# EAGLE schematic design (EAGLE 9.5.1)

## Sheet 1 of 2: DC/DC converters
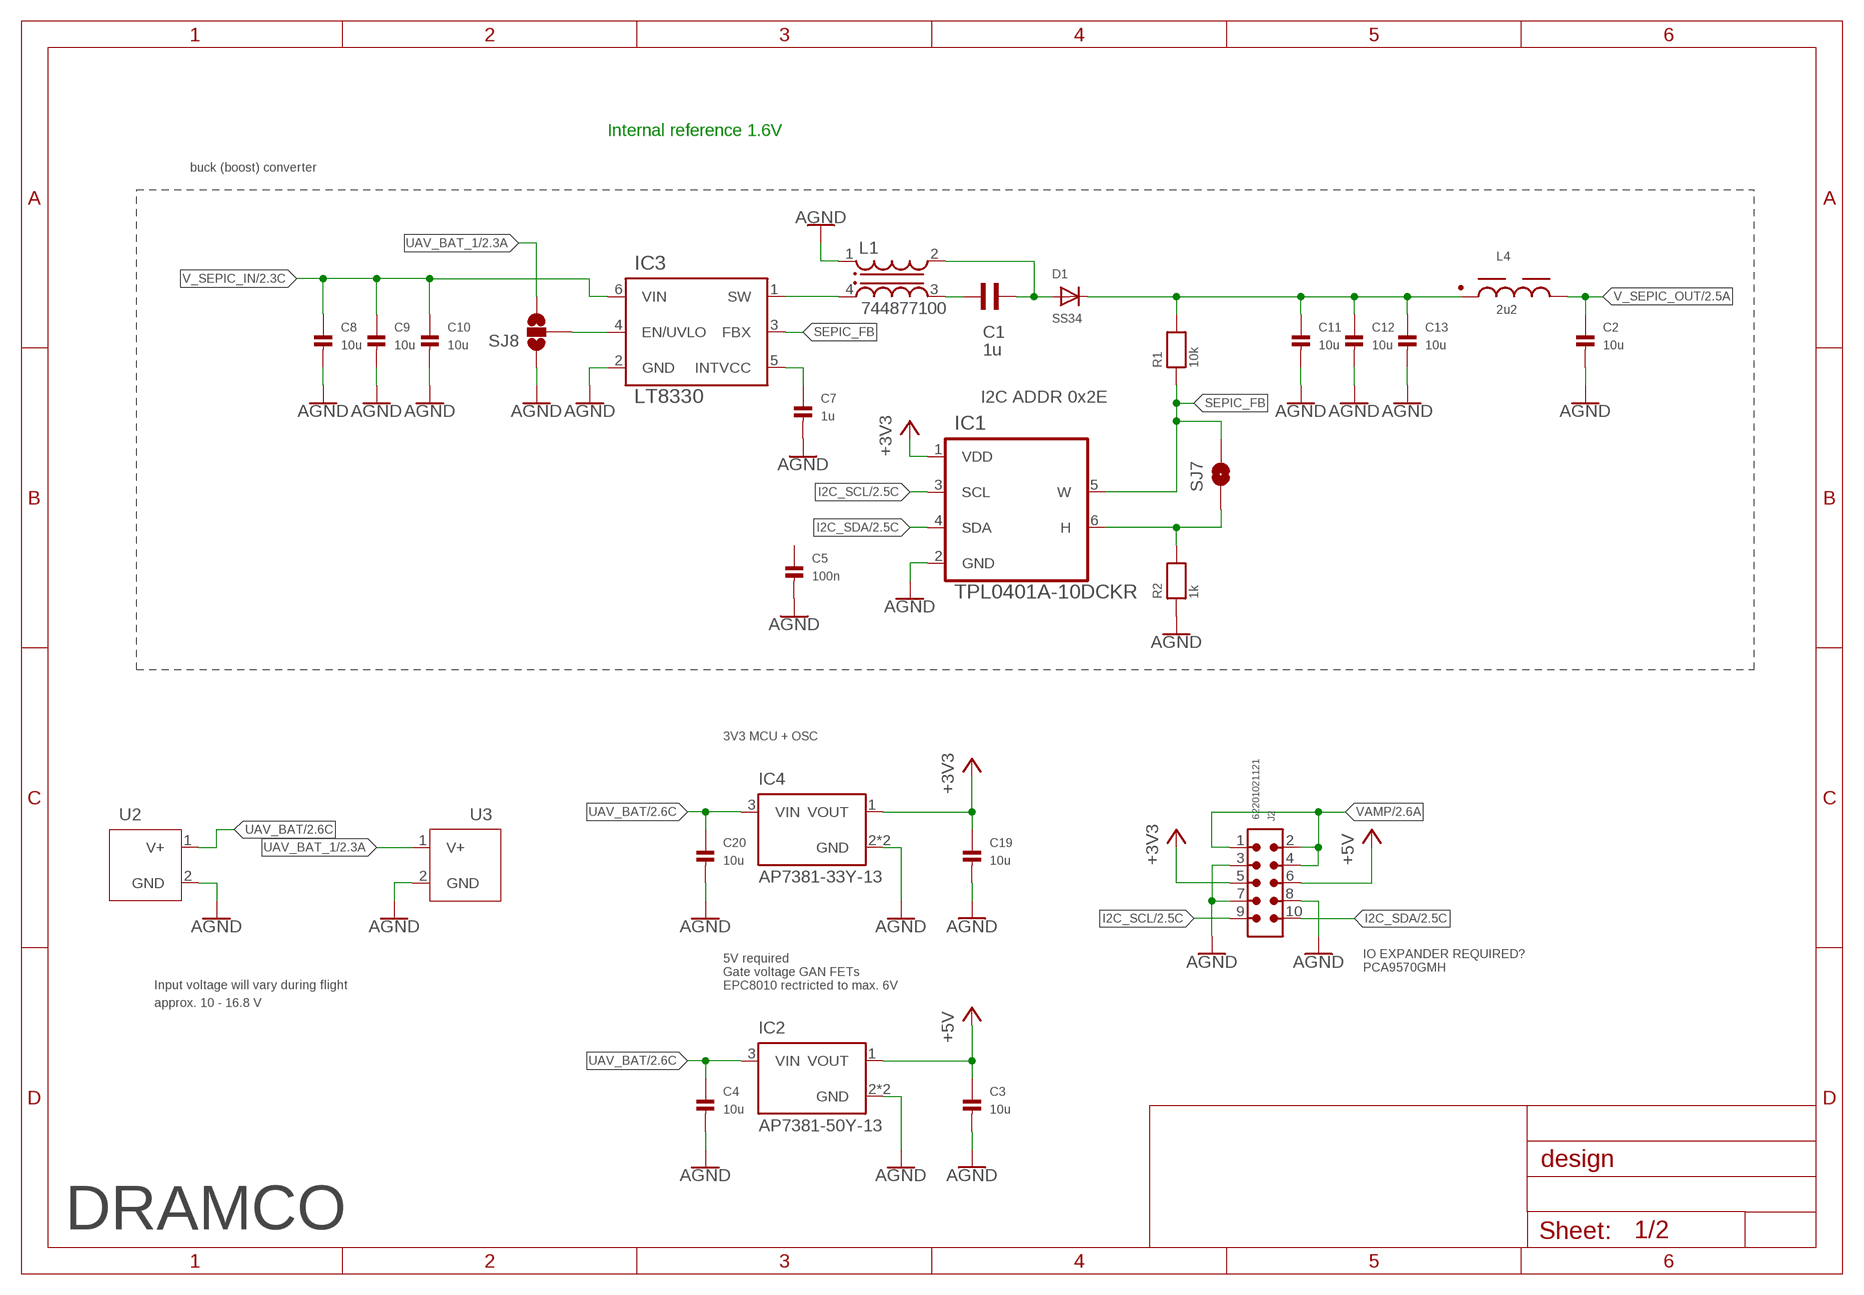
[diagram p0: schematic, sheet 1]

### Parts
C1  1u  WCAP-CSGP_0805_885012207103_WAVE  [WCAP-CSGP_0805_WAVE]
C2  10u  CAP_CERAMIC0805  [0805]
C3  10u  CAP_CERAMIC0603  [0603]
C4  10u  CAP_CERAMIC0603  [0603]
C5  100n  CAP_CERAMIC0402  [0402]
C7  1u  CAP_CERAMIC0603  [0603]
C8  10u  CAP_CERAMIC1206  [1206]
C9  10u  CAP_CERAMIC1206  [1206]
C10  10u  CAP_CERAMIC1206  [1206]
C11  10u  CAP_CERAMIC1206  [1206]
C12  10u  CAP_CERAMIC1206  [1206]
C13  10u  CAP_CERAMIC1206  [1206]
C19  10u  CAP_CERAMIC0603  [0603]
C20  10u  CAP_CERAMIC0603  [0603]
D1  SS34  DIODESOD-123  [SOD-123]
IC1  TPL0401A-10DCKR  [SOT65P210X110-6N]
IC2  AP7381-50Y-13  [FOOT_XC6201P332PR-G]
IC3  LT8330  LT8330ES6TR  [TSOT-23_S6]
IC4  AP7381-33Y-13  AP7381-50Y-13  [FOOT_XC6201P332PR-G]
J2  62201021121  6220XX21121_62201021121  [62201021121]
L1  744877100  WE-DD_7345_744877100  [WE-DD_7345]
L4  2u2  WE-LQS_3015_74404032022  [WE-LQS_3015]
R1  10k  RESISTOR0603  [0603]
R2  1k  RESISTOR0603  [0603]
SJ7  SOLDERJUMPERNO  [SJ_2S-NO]
SJ8  SOLDERJUMPER_2WAYS  [SJ_3]
U2  UAV-CONNECT  [HOLE]
U3  UAV-CONNECT  [HOLE]

### Nets
+3V3: C19.1 IC1.1(VDD) IC4.1(VOUT) J2.5 ; also sheet 2
+5V: C3.1 IC2.1(VOUT) J2.6 ; also sheet 2
AGND: C2.2 C3.2 C4.2 C5.2 C7.2 C8.2 C9.2 C10.2 C11.2 C12.2 C13.2 C19.2 C20.2 IC1.2(GND) IC2.2(GND) IC2.2.1(GND) IC3.2(GND) IC4.2(GND) IC4.2.1(GND) J2.3 J2.7 J2.8 L1.1 R2.1 SJ8.1 U2.2(GND) U3.2(GND) ; also sheet 2
I2C_SCL: IC1.3(SCL) J2.9 ; also sheet 2
I2C_SDA: IC1.4(SDA) J2.10 ; also sheet 2
N$1: IC3.1(SW) L1.4
N$2: C1.2 L1.3
N$5: C7.1 IC3.5(INTVCC)
N$6: C1.1 D1.A L1.2
N$7: C11.1 C12.1 C13.1 D1.C L4.1 R1.2
N$8: IC3.4(EN/UVLO) SJ8.2
N$16: IC1.6(H) R2.2 SJ7.1
SEPIC_FB: IC1.5(W) IC3.3(FBX) R1.1 SJ7.2
UAV_BAT: C4.1 C20.1 IC2.3(VIN) IC4.3(VIN) U2.1(V+) ; also sheet 2
UAV_BAT_1: SJ8.3 U3.1(V+) ; also sheet 2
V_SEPIC_IN: C8.1 C9.1 C10.1 IC3.6(VIN) ; also sheet 2
V_SEPIC_OUT: C2.1 L4.2 ; also sheet 2
VAMP: J2.1 J2.2 J2.4 ; also sheet 2
Unconnected: C5.1

### Notes on the sheet
- Internal reference 1.6V
- buck (boost) converter
- I2C ADDR 0x2E
- 3V3 MCU + OSC
- IO EXPANDER REQUIRED?
  PCA9570GMH
- Input voltage will vary during flight
- 5V required
  Gate voltage GAN FETs
  EPC8010 rectricted to max. 6V
- approx. 10 - 16.8 V
- DRAMCO

## Sheet 2 of 2: Current/voltage sensing
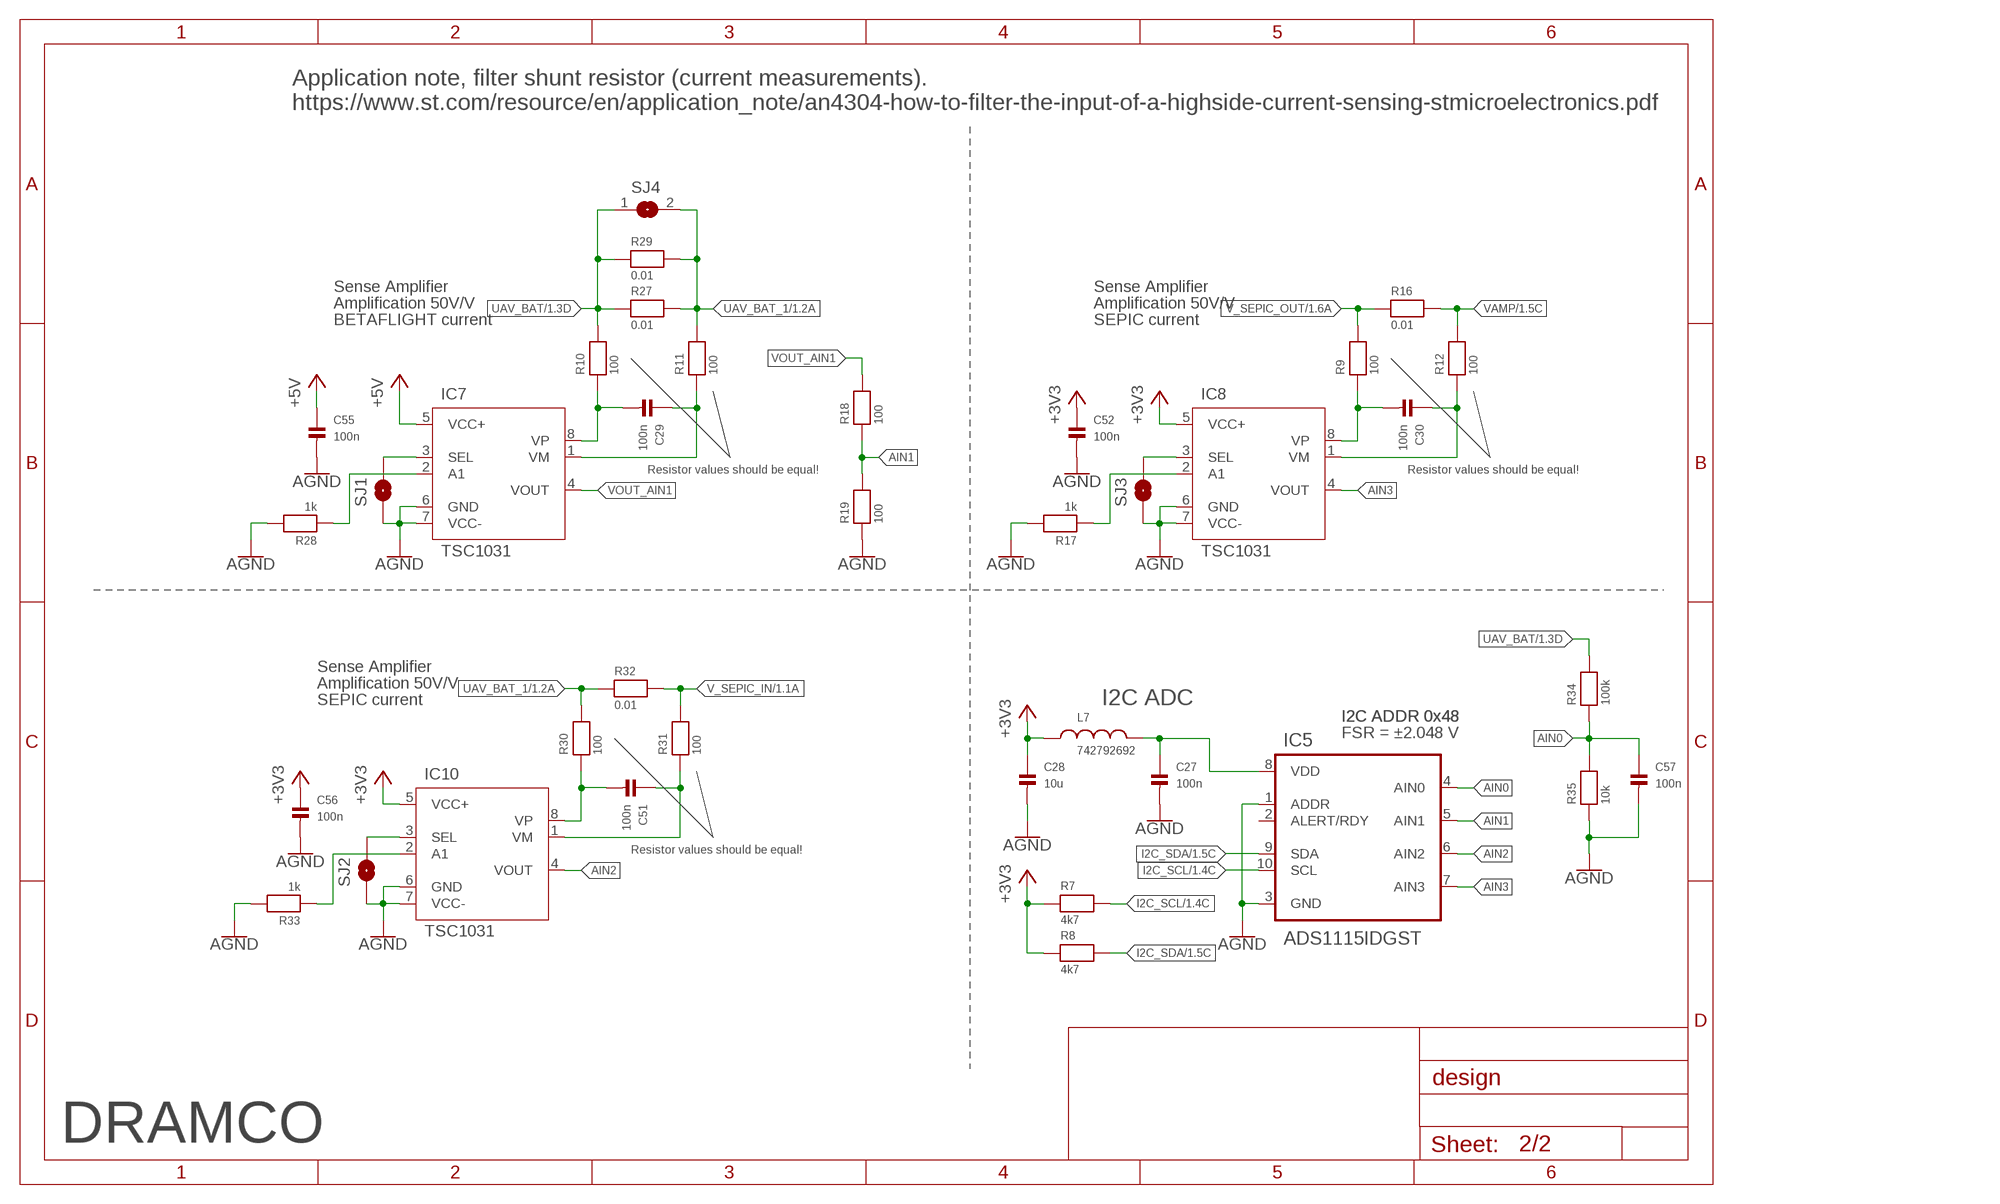
[diagram p1: schematic, sheet 2]

### Parts
C27  100n  CAP_CERAMIC0402  [0402]
C28  10u  CAP_CERAMIC0603  [0603]
C29  100n  CAP_CERAMIC0402  [0402]
C30  100n  CAP_CERAMIC0402  [0402]
C51  100n  CAP_CERAMIC0402  [0402]
C52  100n  CAP_CERAMIC0402  [0402]
C55  100n  CAP_CERAMIC0402  [0402]
C56  100n  CAP_CERAMIC0402  [0402]
C57  100n  CAP_CERAMIC0402  [0402]
IC5  ADS1115IDGST  [SOP50P490X110-10N]
IC7  TSC1031  TSC1031IPT  [SOP65P640X120-8N]
IC8  TSC1031  TSC1031IPT  [SOP65P640X120-8N]
IC10  TSC1031  TSC1031IPT  [SOP65P640X120-8N]
L7  742792692  WE-CBF_0603_742792692_WB_HS  [WE-CBF_0603(W=2.2)]
R7  4k7  RESISTOR0603  [0603]
R8  4k7  RESISTOR0603  [0603]
R9  100  RESISTOR0402  [0402]
R10  100  RESISTOR0402  [0402]
R11  100  RESISTOR0402  [0402]
R12  100  RESISTOR0402  [0402]
R16  0.01  RESISTOR0805  [0805]
R17  1k  RESISTOR0402  [0402]
R18  100  RESISTOR0603  [0603]
R19  100  RESISTOR0603  [0603]
R27  0.01  RESISTOR0805  [0805]
R28  1k  RESISTOR0402  [0402]
R29  0.01  RESISTOR0805  [0805]
R30  100  RESISTOR0402  [0402]
R31  100  RESISTOR0402  [0402]
R32  0.01  RESISTOR0805  [0805]
R33  1k  RESISTOR0402  [0402]
R34  100k  RESISTOR0603  [0603]
R35  10k  RESISTOR0603  [0603]
SJ1  SOLDERJUMPERTRACE  [SJ_2S-TRACE]
SJ2  SOLDERJUMPERTRACE  [SJ_2S-TRACE]
SJ3  SOLDERJUMPERTRACE  [SJ_2S-TRACE]
SJ4  SOLDERJUMPERREFLOW  [SOLDERJUMPER_REFLOW]

### Nets
+3V3: C28.1 C52.1 C56.1 IC8.5(VCC+) IC10.5(VCC+) L7.1 R7.1 R8.1 ; also sheet 1
+5V: C55.1 IC7.5(VCC+) ; also sheet 1
AGND: C27.2 C28.2 C52.2 C55.2 C56.2 C57.2 IC5.1(ADDR) IC5.3(GND) IC7.6(GND) IC7.7(VCC-) IC8.6(GND) IC8.7(VCC-) IC10.6(GND) IC10.7(VCC-) R17.2 R19.1 R28.2 R33.2 R35.1 SJ1.1 SJ2.1 SJ3.1 ; also sheet 1
AIN0: C57.1 IC5.4(AIN0) R34.1 R35.2
AIN1: IC5.5(AIN1) R18.1 R19.2
AIN2: IC5.6(AIN2) IC10.4(VOUT)
AIN3: IC5.7(AIN3) IC8.4(VOUT)
I2C_SCL: IC5.10(SCL) R7.2 ; also sheet 1
I2C_SDA: IC5.9(SDA) R8.2 ; also sheet 1
N$3: C30.1 IC8.1(VM) R12.1
N$4: C27.1 IC5.8(VDD) L7.2
N$11: C30.2 IC8.8(VP) R9.1
N$12: IC8.3(SEL) SJ3.2
N$13: IC8.2(A1) R17.1
N$25: IC7.3(SEL) SJ1.2
N$26: C29.1 IC7.1(VM) R11.1
N$27: C29.2 IC7.8(VP) R10.1
N$29: C51.1 IC10.1(VM) R31.1
N$30: C51.2 IC10.8(VP) R30.1
N$31: IC7.2(A1) R28.1
N$32: IC10.3(SEL) SJ2.2
N$33: IC10.2(A1) R33.1
UAV_BAT: R10.2 R27.1 R29.1 R34.2 SJ4.1 ; also sheet 1
UAV_BAT_1: R11.2 R27.2 R29.2 R30.2 R32.1 SJ4.2 ; also sheet 1
V_SEPIC_IN: R31.2 R32.2 ; also sheet 1
V_SEPIC_OUT: R9.2 R16.1 ; also sheet 1
VAMP: R12.2 R16.2 ; also sheet 1
VOUT_AIN1: IC7.4(VOUT) R18.2
Unconnected: IC5.2(ALERT/RDY)

### Notes on the sheet
- Application note, filter shunt resistor (current measurements). 
  https://www.st.com/resource/en/application_note/an4304-how-to-filter-the-input-of-a-highside-current-sensing-stmicroelectronics.pdf
- Sense Amplifier | Sense Amplifier
- Amplification 50V/V | Amplification 50V/V
- BETAFLIGHT current | SEPIC current
- Resistor values should be equal! | Resistor values should be equal!
- Sense Amplifier
- Amplification 50V/V
- SEPIC current | I2C ADC
- I2C ADDR 0x48 | I2C ADDR 0x48
- FSR = ±2.048 V
- Resistor values should be equal!
- DRAMCO

## Library data of the parts
C1 = Kondensatoren (rev17a):WCAP-CSGP_0805: WCAP-CSGP Ceramic Capacitors Characteristics Multilayer Ceramic Chip Capacitor Recommended soldering:Reflow, for 0603 and 0805 wave soldering is also allowed Operating temperature:-55 °C to +125 °C; Ceramic characteristics: Class I - NPO ; Class II -X7R, X5R High performance ceramic High capacitance stability Minimal aging Termination:Cu/Ni/Sn <http://katalog.we-online.de/media/images/eisos/WCAP-CSGP_pf2.jpg> Details see: http://katalog.we-online.de/en/pbs/WCAP-CSGP-0805? Created: 2015-01-28 2015 (C) Wurth Elektronik
C2-C5 C7-C13 C19 C20 C27-C30 C51 C52 C55-C57 = microbuilder:CAP_CERAMIC: Ceramic Capacitors 0402 - 0402 Surface Mount Capacitors 16pF 50V 5% [Digikey: 445-4899-2-ND] 18pF 50V 5% [Digikey: 490-1281-2-ND] 22pF 50V 5% [Digikey: 490-1283-2-ND] 68pF 50V 5% [Digikey: 490-1289-2-ND] 0.1uF 10V 10% [Digikey: 490-1318-2-ND] 1.0uF 6.3V 10% [Digikey: 490-1320-2-ND] 0603 - 0603 Surface Mount Capacitors 16 pF 50V 5% [Digikey: 445-5051-2-ND] 22 pF 50V [Digikey: PCC220ACVTR-ND] 33 pF 50V 5% [Digikey: 490-1415-1-ND] 56pF 50V 5% [Digikey: 490-1421-1-ND] 220pF 50V 5% [Digikey: 445-1285-1-ND] 680 pF 50V 2200 pF 50V 5% C0G [Digikey: 445-1297-1-ND] 5600 pF 100V 5% X7R [Digikey: 478-3711-1-ND] 0.1 µF 25V 10% [Digikey: PCC2277TR-ND] 0.22 µF 16V 10% X7R [Digikey: 445-1318-1-ND] 1.0 µF 25V 10% [Digikey: 445-5146-2-ND] 0603 - RF Specific 3pF 250V +/-0.1pF RF [Digikey: 712-1347-1-ND] 18 pF 250V 5% [Digikey: 478-3505-1-ND or 712-1322-1-ND] 56 pF 250V 5% C0G RF [Digikey: 490-4867-1-ND] 68 pF 250V RF [Digikey: 490-4868-1-ND] 0805 - 0805 Surface Mount Capacitors 220 pF 250V 2% RF Ceramic Capacitor [Digikey: 712-1398-1-ND] 1000 pF 50V 2% NP0 Ceramic Capacitor [Digikey: 478-3760-1-ND] 0.1 µF 25V 10% Ceramic Capacitor [Digikey: PCC1828TR-ND] 1.0 µF 16V 10% Ceramic Capacitor[Digikey: 490-1691-2-ND] 10.0 µF 10V 10% Ceramic Capacitor[Digikey: 709-1228-1-ND] 10.0 uF 16V 10% Ceramic Capacitor [Digikey: 478-5165-2-ND] 47 uF 6.3V 20% Ceramic Capacitor [Digikey: 587-1779-1-ND or 399-5506-1-ND] 1206 - 1206 Surface Mount Capacitors 47uF 10V 20% Ceramic Capacitor [Digikey: 490-5528-1-ND or 399-5508-1-ND or 445-6010-1-ND] 100uF 6.3V -20%, +80% Y5V Ceramic Capacitor (Digikey: 490-4512-1-ND, Mouser: 81-GRM31CF50J107ZE1L)
D1 = microbuilder:DIODE: Diode SMA Model Volts Amps Type Vf Vr Digikey # Notes SSA34-E3 40V 3A Schottky 480mV @ 3A 200uA @ 40V SSA34-E3/61TGITR-ND CDBA120-G 20V 1A Schottky 500mV @ 1A 500uA @ 20V 641-1014-6-ND REEL MBRA210 10V 2A Schottky 350mV @ 2A 700uA @ 10V MBRA210LT3 SOD-123 Model Volts Amps Type Vf Vr Order # Notes BAT54T1G 30V 200mA Schottky 800mV @ 200mA 2uA @ 25V BAT54T1GOSTR-ND B0530W 30V 500mA Schottky 430mV @ 500mA 130uA @ 30V B0530W-FDICT-ND REEL MBR120 1A 20V Schottky 340mV @ 1A MBR120VLSFT1GOSCT-ND SOD-323 Model Volts Amps Type Vf Vr Order # Notes PMEG2005EJ 20V 500mA Schottky 355mV @ 500mA 568-4110-1-ND ZLLS410 10V 570mA Schottky 380mV @ 570mA ZLLS410CT-ND 1N4148WS 75V 150mA Silicon/Simple 1V 1N4148WSFSCT-ND REEL SOD-523 Model Volts Amps Type Vf Vr Order # Notes BAT54XV2 30V 200mA Schottky 0.8V @ 100mA BAT54XV2CT-ND TB751S 30V 30mA Schottky RB751S-40TE61CT-ND SOT23-R/W (R = Solder Paste/Reflow Ovens, W = Hand-Soldering) Model Volts Amps Type Vf Vr Order # Notes BAT54FILM 40V 300mA Schottky 497-7162-1-ND
IC1 = TPL0401A-10DCKR:TPL0401A-10DCKR: Check availability <https://pricing.snapeda.com/parts/TPL0401A-10DCKR/Texas%20Instruments/view-part?ref=eda>; AVAILABILITY: In Stock; CHECK_PRICES: https://www.snapeda.com/parts/TPL0401A-10DCKR/Texas+Instruments/view-part/?ref=eda; DESCRIPTION: 128-tap single-channel digital potentiometer (digipot) with I2C interface (address 0101110); MF: Texas Instruments; MP: TPL0401A-10DCKR; PACKAGE: SOT-SC70-6 Texas Instruments; PRICE: None; PURCHASE-URL: https://pricing.snapeda.com/search?q=TPL0401A-10DCKR&ref=eda; SNAPEDA_LINK: https://www.snapeda.com/parts/TPL0401A-10DCKR/Texas+Instruments/view-part/?ref=snap
IC2 IC4 = AP7381:AP7381-50Y-13: 250mA CMOS LDO, Isupply 1uA and 2% Vout Accuracy 3 SOT-89 T/R; AVAILABILITY: Unavailable; DESCRIPTION: 250mA CMOS LDO, Isupply 1uA and 2% Vout Accuracy 3 SOT-89 T/R; MF: Microchip; MP: MCP1700T-3602E/MB; PACKAGE: SOT-89 Microchip; PRICE: None
IC3 = LT8330ES6TR:LT8330ES6TR: Check availability <https://pricing.snapeda.com/parts/LT8330ES6%23TR/Analog%20Devices/view-part?ref=eda>; AVAILABILITY: In Stock; CHECK_PRICES: https://www.snapeda.com/parts/LT8330ES6%23TR/Analog+Devices/view-part/?ref=eda; DESCRIPTION: Boost, SEPIC Switching Regulator IC Positive or Negative, Isolation Capable Adjustable 1.6V, -0.8V 1 Output 1A SOT-23-6 Thin, TSOT-23-6; MF: Analog Devices; MP: LT8330ES6#TR; PACKAGE: SOT-23-6 Linear Technology; PRICE: None; SNAPEDA_LINK: https://www.snapeda.com/parts/LT8330ES6%23TR/Analog+Devices/view-part/?ref=snap
IC5 = ADS1115IDGST:ADS1115IDGST: Analog-to-Digital Converter with Internal Reference; AVAILABILITY: Unavailable; DESCRIPTION: 16-Bit ADC with Integrated MUX, PGA, Comparator, Oscillator, and Reference 10-VSSOP -40 to 125; MF: Texas Instruments; MP: ADS1115IDGST; PACKAGE: MSOP-10 Texas Instruments; PRICE: None
IC7 IC8 IC10 = TSC1031:TSC1031IPT
J2 = Eagle_WR-PHD (rev22a):6220XX21121_62201021121: WR-PHD 1.27 mm THT Dual Pin Header ARTICLE PROPERTIES: Pins:4;​ 8;​ 10;​ 14;​ 16;​ 20;​ 28 KIND PROPERTIES: Pitch：1.27 mm Quality Class:3 as per CECC 75 301-802 Rows：Dual Gender：Pin Header Type：Straight MATERIAL PROPERTIES: Insulator Material :PA9T Insulator Flammability Rating:UL94 V-0 Contact Material:Copper Alloy Contact Plating:Gold Contact Type:Stamped GENERAL INFORMATION Operating Temperature:-40 up to +105 °C Compliance:Lead free / RoHS ELECTRICAL PROPERTIES: Rated Current:1 A;​ max. IR1:1 A Withstanding Voltage:500 V (AC) Contact Resistance:20 mΩ RISO:1000 MΩ CERTIFICATION UL Approval:E323964 PACKAGING PROPERTIES Packaging:Box Packaging Unit:1000;​ 800;​ 500;​ 200 <https://katalog.we-online.com/media/images/v2/o33223v209%20Family_WR-PHD_6220xx21121.jpg> Details see: https://katalog.we-online.com/en/em/PHD_1_27_THT_DUAL_PIN_HEADER_6220XX21121 Updated by Yingchun,Shan 2019-10-25 2019 (C) Würth Elektronik; DATASHEET-URL: https://www.we-online.com/redexpert/spec/62201021121?ae; GENDER: Pin Header; IR: 1A; MOUNT: THT; PACKAGING: Box; PART-NUMBER: 62201021121; PINS: 10; PITCH: 1.27mm; ROWS: Dual; TYPE: Straight
L1 = PowerMagnetics (rev18e):WE-DD_7345: WE-DD SMD Shielded Coupled Inductor Characteristics 1:1 transformer Double inductor with two identical windings 4 different sizes available Operating temperature: –40 ºC to +125 ºC Recommended solder profile: Reflow Custom designs on request Applications For SEPIC and CUK topologies Flyback applications Switching regulators with second, unregulated output voltages <http://katalog.we-online.de/media/images/v2/Family_WE-DD.jpg> Details see: http://katalog.we-online.de/en/pbs/WE-DD Updated by Dan Xu 2014-06-10 2014 (C) Wurth Elektronik; WE-NUMBER: 744877100/10uH
L4 = EMCComponents (rev19b):WE-LQS_3015: SMD Shielded Tiny Power Inductor Characteristics Tiny Power Inductor design 1.7 times more current in comparison with unshielded versions Robust design & high durability Low RDC Magnetically shielded with magnetic glue reducing buzz noise in ultra-low levels Operating Temperature: –40 °C to +125 °C Applications Integrated DC/DC Converters Switching controllers which required high efficiency Portable power (Smartphones, digital cameras, Tablets, etc.) Embedded laptops and PCs Big sizes (5040, 60xx, 8040) used for shock-proof circuits <http://katalog.we-online.de/media/images/v2/Family_WE-LQS.jpg> Details see: http://katalog.we-online.de/en/pbs/WE-LQS Created by Dan Xu 2014-05-21 2014 (C) Wurth Elektronik; WE-NUMBER: 74404032022/2,2uH
L7 = PowerMagnetics (rev18e):WE-CBF_0603: WE-CBF SMD EMI Suppression Ferrite Bead Characteristics Reliable Ni-Sn electrodes High rated current up to 6 A Operating temperature: –55 ºC to +125 ºC Applications Perfect as data lined filter and for uncoupling of distribution voltage Variant abbreviation WB means WIDE BAND HS means HIGH SPEED HC means HIGH CURRENT <http://katalog.we-online.de/media/images/v2/Family_WE-CBF.jpg> Details see: http://katalog.we-online.de/en/pbs/WE-CBF Updated on 2014-06-19 2014 (C) Wurth Elektronik; WE-NUMBER: 742792692/1800Ω(Z@100MHz)
R1 R2 R7-R12 R16-R19 R27-R35 = microbuilder:RESISTOR: Resistors 0402 - 0402 Surface Mount Package 22 Ohm 1% 1/16W [Digikey: 311-22.0LRTR-ND] 33 Ohm 5% 1/16W 1.0K 5% 1/16W 1.5K 5% 1/16W 2.0K 1% 1/16W 10.0K 1% 1/16W [Digikey: 311-10.0KLRTR-ND] 10.0K 5% 1/16W [Digikey: RMCF0402JT10K0TR-ND] 12.1K 1% 1/16W [Digikey: 311-22.0LRTR-ND] 100.0K 5% 1/16W 0603 - 0603 Surface Mount Package 0 Ohm 1/10 Watt 1% Resistor 15 Ohm 1/10 Watt 1% Resistor 33 Ohm 1/10 Watt 1% Resistor 49.9 Ohm 1/10 Watt 1% Resistor 100 Ohm 1/10 Watt 1% Resistor 150 Ohm 1/10 Watt 1% Resistor 240 Ohm 1/10 Watt 1% Resistor 390 Ohm 1/10 Watt 1% Resistor 560 Ohm 1/10 Watt 1% Resistor 680 Ohm 1/10 Watt 1% Resistor 750 Ohm 1/10 Watt 1% Resistor 1.0K Ohm 1/10 Watt 1% Resistor 1.5K Ohm 1/10 Watt 1% Resistor 2.0K Ohm 1/10 Watt 1% Resistor 2.2K Ohm 1/10 Watt 1% Resistor 3.3K Ohm 1/10 Watt 1% Resistor 4.7K Ohm 1/10 Watt 1% Resistor 10.0K Ohm 1/10 Watt 1% Resistor 12.0K Ohm 1/10 Watt 1% Resistor 12.1K Ohm 1/10 Watt 1% Resistor 20.0K Ohm 1/10 Watt 1% Resistor 33.0K Ohm 1/10 Watt 1% Resistor 100.0K Ohm 1/10 Watt 1% Resistor 0805 - 0805 Surface Mount Package 0 Ohm 1/8 Watt 1% Resistor 33 Ohm 1/8 Watt 1% Resistor 100 Ohm 1/8 Watt 1% Resistor 150 Ohm 1/8 Watt 1% Resistor 200 Ohm 1/8 Watt 1% Resistor 240 Ohm 1/8 Watt 1% Resistor 330 Ohm 1/8 Watt 1% Resistor 390 Ohm 1/8 Watt 1% Resistor 470 Ohm 1/8 Watt 1% Resistor 1.0K Ohm 1/8 Watt 1% Resistor 1.5K Ohm 1/8 Watt 1% Resistor 2.0K Ohm 1/8 Watt 1% Resistor 4.7K Ohm 1/8 Watt 1% Resistor 5.1K Ohm 1/8 Watt 1% Resistor 5.6K Ohm 1/8 Watt 1% Resistor 10.0K Ohm 1/8 Watt 1% Resistor 22.0K Ohm 1/8 Watt 1% Resistor 33.0K Ohm 1/8 Watt 1% Resistor 100K Ohm 1/8 Watt 1% Resistor 1206 - 1206 Surface Mount Package 2012 - 2010 Surface Mount Package 0.11 Ohm 1/2 Watt 1% Resistor - Digikey: RHM.11UCT-ND
SJ1-SJ3 SJ7 = SparkFun-Retired:SOLDERJUMPER: Solder Jumper Standard SMD solder jumper. Used to automate production. Two varients : Normally Open and Normally Closed are the same, but have different paste layers. NC will have a large amount of paste and should jumper during reflow.
SJ4 = microbuilder:SOLDERJUMPER: SMD Solder JUMPER Solder the two pads together to create a connection, or remove the solder to break it. REFLOW - Use this footprint for solder paste and reflow ovens. WAVE - Use this footprint for hand-soldering (larger pads). CLOSED - Has a trace between the two pads to ensure it is closed by default. The trace needs to be cut to disable the jumper, and can be closed again by creating a solder bridge between the two pads.
SJ8 = SparkFun-Retired:SOLDERJUMPER_2WAY: Solder Jumper 2 way solder jumper
U2 U3 = UAV-connector:UAV-CONNECT